# Altium schematic sheet STM32H730_PINOUT.SchDoc
size D; SheetNumber: 2; SheetTotal: 8
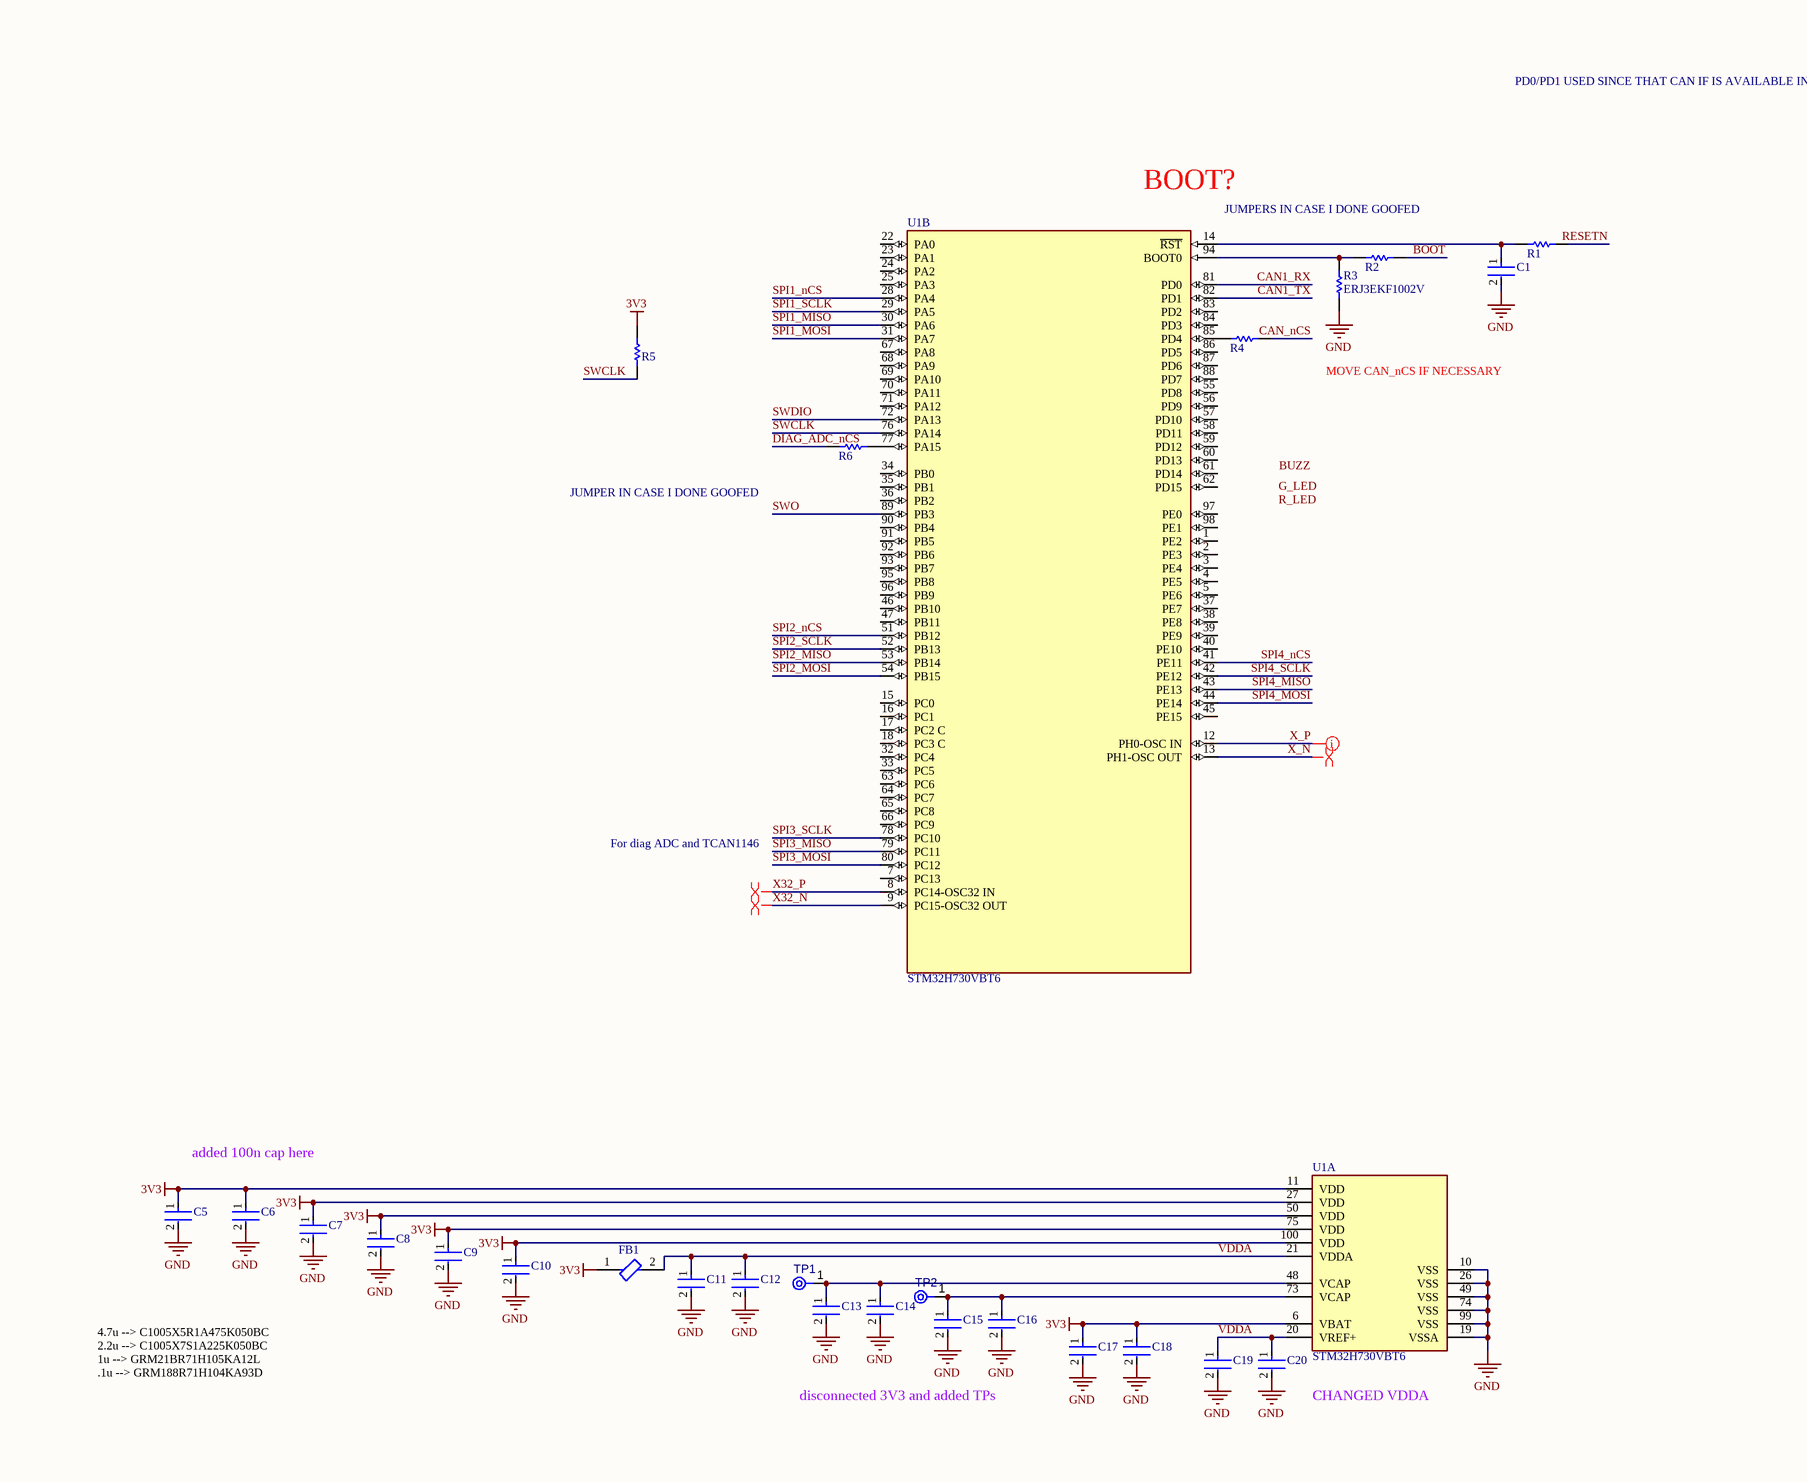
[diagram p0: STM32H730_PINOUT.SchDoc, top left]
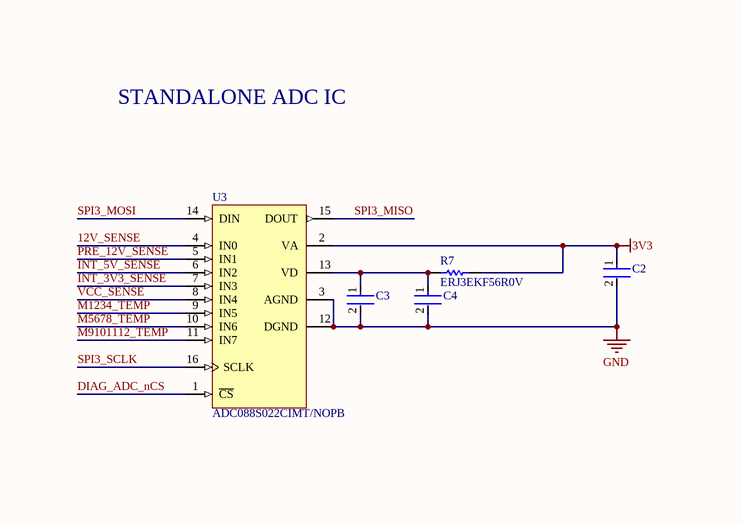
[diagram p1: STM32H730_PINOUT.SchDoc, top middle]
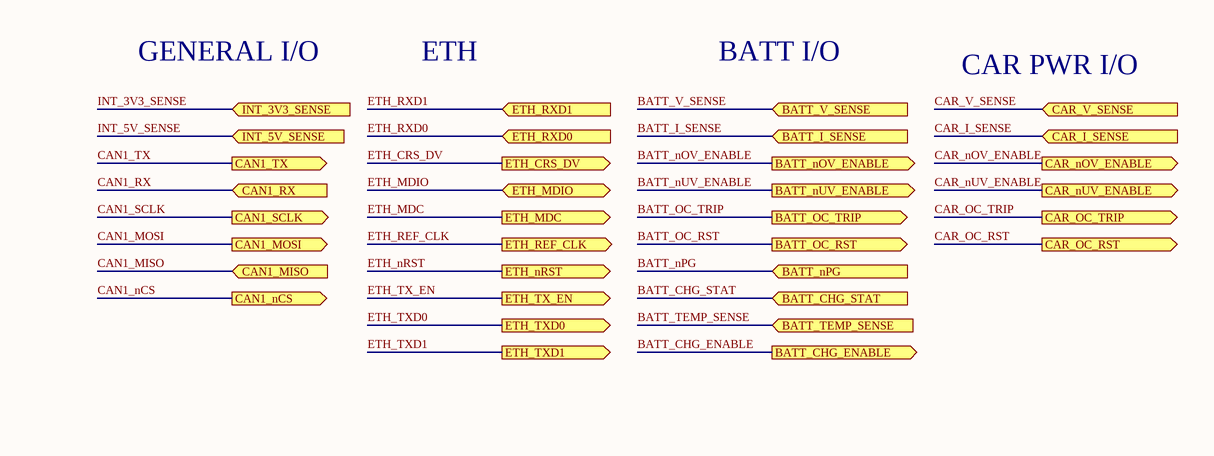
[diagram p2: STM32H730_PINOUT.SchDoc, top right]
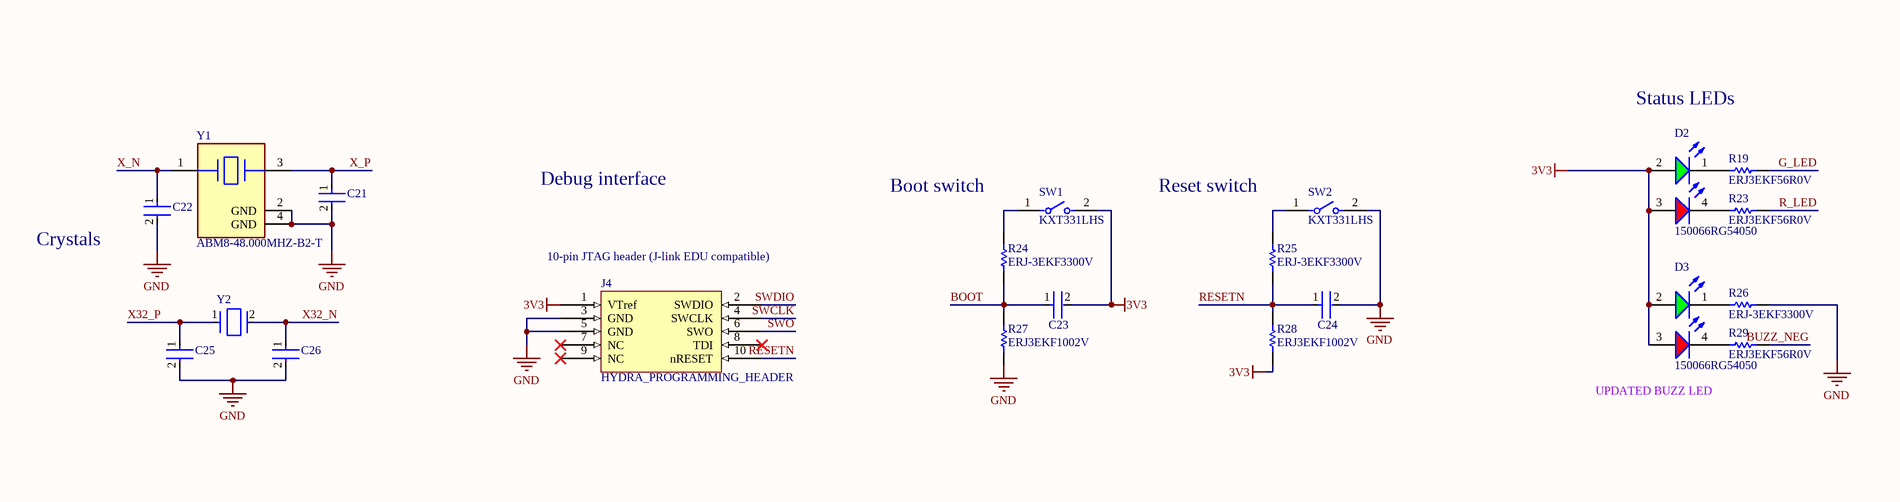
[diagram p3: STM32H730_PINOUT.SchDoc, bottom left]
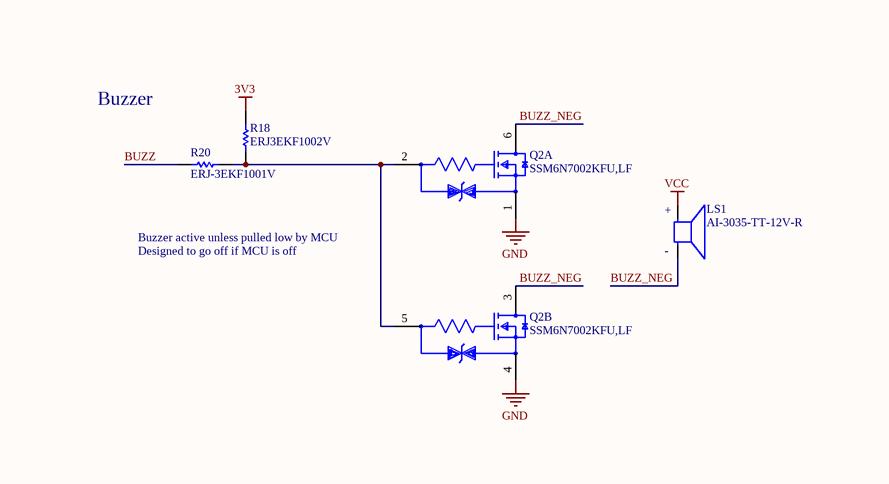
[diagram p4: STM32H730_PINOUT.SchDoc, bottom middle]
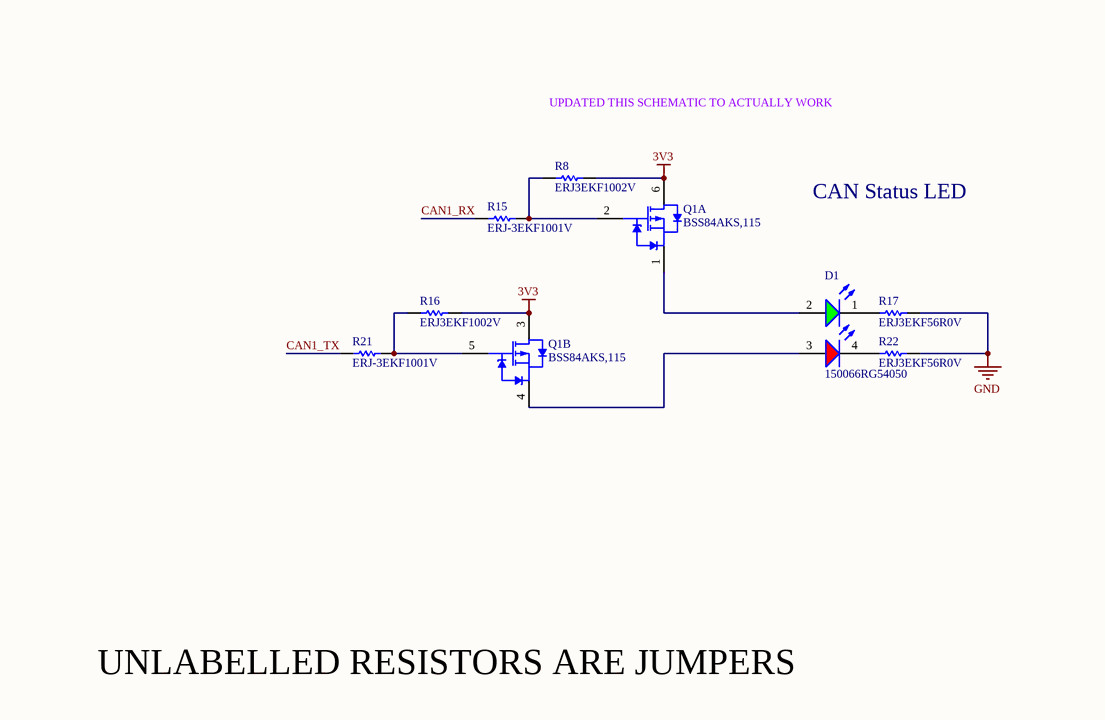
[diagram p5: STM32H730_PINOUT.SchDoc, bottom right]

## Parts
C1  GRM188R71H104KA93D  [FP-0402-L_1_0_0_05-W_0_5-IPC_A]  (value not drawn)
C2  GRM188R71H104KA93D  [FP-0402-L_1_0_0_05-W_0_5-IPC_A]  (value not drawn)
C3  GRM188R71H104KA93D  [FP-0402-L_1_0_0_05-W_0_5-IPC_A]  (value not drawn)
C4  GRM188R71H104KA93D  [FP-0402-L_1_0_0_05-W_0_5-IPC_A]  (value not drawn)
C5  C1005X5R1A475K050BC  [FP-0402-L_1_0_0_05-W_0_5-IPC_A]  (value not drawn)
C6  GRM188R71H104KA93D  [FP-0402-L_1_0_0_05-W_0_5-IPC_A]  (value not drawn)
C7  GRM188R71H104KA93D  [FP-0402-L_1_0_0_05-W_0_5-IPC_A]  (value not drawn)
C8  GRM188R71H104KA93D  [FP-0402-L_1_0_0_05-W_0_5-IPC_A]  (value not drawn)
C9  GRM188R71H104KA93D  [FP-0402-L_1_0_0_05-W_0_5-IPC_A]  (value not drawn)
C10  GRM188R71H104KA93D  [FP-0402-L_1_0_0_05-W_0_5-IPC_A]  (value not drawn)
C11  GRM21BR71H105KA12L  [FP-0402-L_1_0_0_05-W_0_5-IPC_A]  (value not drawn)
C12  GRM188R71H104KA93D  [FP-0402-L_1_0_0_05-W_0_5-IPC_A]  (value not drawn)
C13  C1005X7S1A225K050BC  [FP-0402-L_1_0_0_05-W_0_5-IPC_A]  (value not drawn)
C14  GRM188R71H104KA93D  [FP-0402-L_1_0_0_05-W_0_5-IPC_A]  (value not drawn)
C15  C1005X7S1A225K050BC  [FP-0402-L_1_0_0_05-W_0_5-IPC_A]  (value not drawn)
C16  GRM188R71H104KA93D  [FP-0402-L_1_0_0_05-W_0_5-IPC_A]  (value not drawn)
C17  GRM21BR71H105KA12L  [FP-0402-L_1_0_0_05-W_0_5-IPC_A]  (value not drawn)
C18  GRM188R71H104KA93D  [FP-0402-L_1_0_0_05-W_0_5-IPC_A]  (value not drawn)
C19  GRM21BR71H105KA12L  [FP-0402-L_1_0_0_05-W_0_5-IPC_A]  (value not drawn)
C20  GRM188R71H104KA93D  [FP-0402-L_1_0_0_05-W_0_5-IPC_A]  (value not drawn)
C21  DNO  [FP-0402-L_1_0_0_05-W_0_5-IPC_A]  (value not drawn)
C22  DNO  [FP-0402-L_1_0_0_05-W_0_5-IPC_A]  (value not drawn)
C23  GRM188R71H104KA93D  [FP-0402-L_1_0_0_05-W_0_5-IPC_A]  (value not drawn)
C24  GRM188R71H104KA93D  [FP-0402-L_1_0_0_05-W_0_5-IPC_A]  (value not drawn)
C25  04025A180FAT2A  [FP-0402-L_1_0_0_05-W_0_5-IPC_A]  (value not drawn)
C26  04025A180FAT2A  [FP-0402-L_1_0_0_05-W_0_5-IPC_A]  (value not drawn)
D1  150066RG54050  [WL-SBCD_0606]
D2  150066RG54050  [WL-SBCD_0606]
D3  150066RG54050  [WL-SBCD_0606]
FB1  BLM15PX601SN1D  [FP-BLM15-0_05-MFG]  (value not drawn)
J4  HYDRA_PROGRAMMING_HEADER  [3220-10-0300-00-Footprint-1]
LS1  AI-3035-TT-12V-R  [AI-3035-TT-12V-R-Footprint-1]
Q1  BSS84AKS,115  [NXP-SOT363_L]  (parts A,B of 2)
Q2  SSM6N7002KFU,LF  [FP-SSOP6-P-0_65A-MFG]  (parts A,B of 2)
R1  0402 JUMPER 0 OHM  [RESC1005X40X25NL05T05]  (value not drawn)
R2  0402 JUMPER 0 OHM  [RESC1005X40X25NL05T05]  (value not drawn)
R3  ERJ3EKF1002V  [RESC1609X55X30LL15T15]
R4  0402 JUMPER 0 OHM  [RESC1005X40X25NL05T05]  (value not drawn)
R5  ERJ3EKF1002V  [RESC1609X55X30LL15T15]  (value not drawn)
R6  0402 JUMPER 0 OHM  [RESC1005X40X25NL05T05]  (value not drawn)
R7  ERJ3EKF56R0V  [RESC1608X55X30NL15T15]
R8  ERJ3EKF1002V  [RESC1609X55X30LL15T15]
R15  ERJ-3EKF1001V  [RESC1608X55X30LL15T15]
R16  ERJ3EKF1002V  [RESC1609X55X30LL15T15]
R17  ERJ3EKF56R0V  [RESC1608X55X30NL15T15]
R18  ERJ3EKF1002V  [RESC1609X55X30LL15T15]
R19  ERJ3EKF56R0V  [RESC1608X55X30NL15T15]
R20  ERJ-3EKF1001V  [RESC1608X55X30LL15T15]
R21  ERJ-3EKF1001V  [RESC1608X55X30LL15T15]
R22  ERJ3EKF56R0V  [RESC1608X55X30NL15T15]
R23  ERJ3EKF56R0V  [RESC1608X55X30NL15T15]
R24  ERJ-3EKF3300V  [RESC1608X55X30LL15T15]
R25  ERJ-3EKF3300V  [RESC1608X55X30LL15T15]
R26  ERJ-3EKF3300V  [RESC1608X55X30LL15T15]
R27  ERJ3EKF1002V  [RESC1609X55X30LL15T15]
R28  ERJ3EKF1002V  [RESC1609X55X30LL15T15]
R29  ERJ3EKF56R0V  [RESC1608X55X30NL15T15]
SW1  KXT331LHS  [FP-KXT331LHS-MFG]
SW2  KXT331LHS  [FP-KXT331LHS-MFG]
TP1  TPAD6R  [TP06R]  (value not drawn)  (no BOM)
TP2  TPAD6R  [TP06R]  (value not drawn)  (no BOM)
U1  STM32H730VBT6  [FP-LQFP100-1L-IPC_C]  (parts A,B of 2)
U3  ADC088S022CIMT/NOPB  [MTC16_L]
Y1  ABM8-48.000MHZ-B2-T  [FP-ABM8-MFG]
Y2  ECS-.327-12.5-1210-TR  [FP-ECX-1210-MFG]  (value not drawn)

## Ports
BATT_CHG_ENABLE (out, see BRZ_BATT_MGR[4B]), BATT_CHG_STAT (in, see BRZ_BATT_MGR[4B]), BATT_I_SENSE (in, see BRZ_BATT_MGR[4B]), BATT_nOV_ENABLE (out, see BRZ_BATT_MGR[4B]), BATT_nPG (in, see BRZ_BATT_MGR[4B]), BATT_nUV_ENABLE (out, see BRZ_BATT_MGR[4B]), BATT_OC_RST (out, see BRZ_BATT_MGR[4B]), BATT_OC_TRIP (out, see BRZ_BATT_MGR[4B]), BATT_TEMP_SENSE (in, see BRZ_BATT_MGR[4B]), BATT_V_SENSE (in, see BRZ_BATT_MGR[4B]), CAN1_MISO (in, see BRZ_BATT_MGR[5A]), CAN1_MOSI (out, see BRZ_BATT_MGR[5A]), CAN1_nCS (out, see BRZ_BATT_MGR[5A]), CAN1_RX (in, see BRZ_BATT_MGR[5A]), CAN1_SCLK (out, see BRZ_BATT_MGR[5A]), CAN1_TX (out, see BRZ_BATT_MGR[5A]), CAR_I_SENSE (in, see BRZ_BATT_MGR[4C]), CAR_nOV_ENABLE (out, see BRZ_BATT_MGR[4C]), CAR_nUV_ENABLE (out, see BRZ_BATT_MGR[4C]), CAR_OC_RST (out, see BRZ_BATT_MGR[4C]), CAR_OC_TRIP (out, see BRZ_BATT_MGR[4C]), CAR_V_SENSE (in, see BRZ_BATT_MGR[4C]), ETH_CRS_DV (out, see BRZ_BATT_MGR[5C], ETH[1A]), ETH_MDC (out, see BRZ_BATT_MGR[5C], ETH[1A]), ETH_MDIO (bidir, see BRZ_BATT_MGR[5C], ETH[1A]), ETH_nRST (out, see BRZ_BATT_MGR[5C], ETH[1A]), ETH_REF_CLK (out, see BRZ_BATT_MGR[5C], ETH[1A]), ETH_RXD0 (in, see BRZ_BATT_MGR[5C], ETH[1A]), ETH_RXD1 (in, see BRZ_BATT_MGR[5C], ETH[1A]), ETH_TX_EN (out, see BRZ_BATT_MGR[5C], ETH[1A]), ETH_TXD0 (out, see BRZ_BATT_MGR[5C], ETH[1A]), ETH_TXD1 (out, see BRZ_BATT_MGR[5C], ETH[1A]), INT_3V3_SENSE (in, see BRZ_BATT_MGR[4A], INT_REG[4A]), INT_5V_SENSE (in, see BRZ_BATT_MGR[4A], INT_REG[4B])

## Nets
3V3: C2.1 C5.1 C6.1 C7.1 C8.1 C9.1 C10.1 C17.1 C18.1 C23.2 D2.2(A) D2.3(A) D3.2(A) D3.3(A) FB1.1 J4.1(VTref) Q1.3(D2) Q1.6(D1) R5.1 R7.1 R8.2 R16.2 R18.2 R28.1 SW1.2 U1.6(VBAT) U1.11(VDD) U1.27(VDD) U1.50(VDD) U1.75(VDD) U1.100(VDD) U3.2(VA)
GND: C1.2 C2.2 C3.2 C4.2 C5.2 C6.2 C7.2 C8.2 C9.2 C10.2 C11.2 C12.2 C13.2 C14.2 C15.2 C16.2 C17.2 C18.2 C19.2 C20.2 C21.2 C22.2 C24.2 C25.2 C26.2 J4.3(GND) J4.5(GND) Q2.1(Source1) Q2.4(Source2) R3.1 R17.1 R22.1 R26.2 R27.1 SW2.2 U1.10(VSS) U1.19(VSSA) U1.26(VSS) U1.49(VSS) U1.74(VSS) U1.99(VSS) U3.3(AGND) U3.12(DGND) Y1.2(GND) Y1.4(GND)
VCC: LS1.P
12V_SENSE: U3.4(IN0)
BATT_CHG_ENABLE: port BATT_CHG_ENABLE
BATT_CHG_STAT: port BATT_CHG_STAT
BATT_I_SENSE: port BATT_I_SENSE
BATT_nOV_ENABLE: port BATT_nOV_ENABLE
BATT_nPG: port BATT_nPG
BATT_nUV_ENABLE: port BATT_nUV_ENABLE
BATT_OC_RST: port BATT_OC_RST
BATT_OC_TRIP: port BATT_OC_TRIP
BATT_TEMP_SENSE: port BATT_TEMP_SENSE
BATT_V_SENSE: port BATT_V_SENSE
BOOT: C23.1 R2.2 R24.1 R27.2
BUZZ: R20.1
BUZZ_NEG: LS1.N Q2.3(Drain2) Q2.6(Drain1) R29.1
CAN1_MISO: port CAN1_MISO
CAN1_MOSI: port CAN1_MOSI
CAN1_nCS: port CAN1_nCS
CAN1_RX: R15.1 U1.81(PD0) ; port CAN1_RX
CAN1_SCLK: port CAN1_SCLK
CAN1_TX: R21.1 U1.82(PD1) ; port CAN1_TX
CAN_nCS: R4.2
CAR_I_SENSE: port CAR_I_SENSE
CAR_nOV_ENABLE: port CAR_nOV_ENABLE
CAR_nUV_ENABLE: port CAR_nUV_ENABLE
CAR_OC_RST: port CAR_OC_RST
CAR_OC_TRIP: port CAR_OC_TRIP
CAR_V_SENSE: port CAR_V_SENSE
DIAG_ADC_nCS: R6.1 U3.1(~{CS})
ETH_CRS_DV: port ETH_CRS_DV
ETH_MDC: port ETH_MDC
ETH_MDIO: port ETH_MDIO
ETH_nRST: port ETH_nRST
ETH_REF_CLK: port ETH_REF_CLK
ETH_RXD0: port ETH_RXD0
ETH_RXD1: port ETH_RXD1
ETH_TX_EN: port ETH_TX_EN
ETH_TXD0: port ETH_TXD0
ETH_TXD1: port ETH_TXD1
G_LED: R19.1
INT_3V3_SENSE: U3.7(IN3) ; port INT_3V3_SENSE
INT_5V_SENSE: U3.6(IN2) ; port INT_5V_SENSE
M1234_TEMP: U3.9(IN5)
M5678_TEMP: U3.10(IN6)
M9101112_TEMP: U3.11(IN7)
PRE_12V_SENSE: U3.5(IN1)
R_LED: R23.1
RESETN: C24.1 J4.10(nRESET) R1.2 R25.1 R28.2
SPI1_MISO: U1.30(PA6)
SPI1_MOSI: U1.31(PA7)
SPI1_nCS: U1.28(PA4)
SPI1_SCLK: U1.29(PA5)
SPI2_MISO: U1.53(PB14)
SPI2_MOSI: U1.54(PB15)
SPI2_nCS: U1.51(PB12)
SPI2_SCLK: U1.52(PB13)
SPI3_MISO: U1.79(PC11) U3.15(DOUT)
SPI3_MOSI: U1.80(PC12) U3.14(DIN)
SPI3_SCLK: U1.78(PC10) U3.16(SCLK)
SPI4_MISO: U1.43(PE13)
SPI4_MOSI: U1.44(PE14)
SPI4_nCS: U1.41(PE11)
SPI4_SCLK: U1.42(PE12)
SWCLK: J4.4(SWCLK) R5.2 U1.76(PA14)
SWDIO: J4.2(SWDIO) U1.72(PA13)
SWO: J4.6(SWO) U1.89(PB3)
VCC_SENSE: U3.8(IN4)
VDDA: C11.1 C12.1 C19.1 C20.1 FB1.2 U1.20(VREF+) U1.21(VDDA)
X32_N: C26.1 U1.9(PC15-OSC32_OUT) Y2.2(Out/In)
X32_P: C25.1 U1.8(PC14-OSC32_IN) Y2.1(In/Out)
X_N: C22.1 U1.13(PH1-OSC_OUT) Y1.1
X_P: C21.1 U1.12(PH0-OSC_IN) Y1.3
NetC1_1: C1.1 R1.1 U1.14(~{RST})
NetC3_1: C3.1 C4.1 R7.2 U3.13(VD)
NetC13_1: C13.1 C14.1 TP1.1(TP) U1.48(VCAP)
NetC15_1: C15.1 C16.1 TP2.1(TP) U1.73(VCAP)
NetD1_1: D1.1(K) R17.2
NetD1_2: D1.2(A) Q1.1(S1)
NetD1_3: D1.3(A) Q1.4(S2)
NetD1_4: D1.4(K) R22.2
NetD2_1: D2.1(K) R19.2
NetD2_4: D2.4(K) R23.2
NetD3_1: D3.1(K) R26.1
NetD3_4: D3.4(K) R29.2
NetQ1_2: Q1.2(G1) R8.1 R15.2
NetQ1_5: Q1.5(G2) R16.1 R21.2
NetQ2_2: Q2.2(Gate1) Q2.5(Gate2) R18.1 R20.2
NetR2_1: R2.1 R3.2 U1.94(BOOT0)
NetR4_1: R4.1 U1.85(PD4)
NetR6_2: R6.2 U1.77(PA15)
NetR24_2: R24.2 SW1.1
NetR25_2: R25.2 SW2.1

Not connected (* = marked no-connect by the designer): J4 7(NC)* 8(TDI)* 9(NC)*; U1 1(PE2) 2(PE3) 3(PE4) 4(PE5) 5(PE6) 7(PC13) 15(PC0) 16(PC1) 17(PC2_C) 18(PC3_C) 22(PA0) 23(PA1) 24(PA2) 25(PA3) 32(PC4) 33(PC5) 34(PB0) 35(PB1) 36(PB2) 37(PE7) 38(PE8) 39(PE9) 40(PE10) 45(PE15) 46(PB10) 47(PB11) 55(PD8) 56(PD9) 57(PD10) 58(PD11) 59(PD12) 60(PD13) 61(PD14) 62(PD15) 63(PC6) 64(PC7) 65(PC8) 66(PC9) 67(PA8) 68(PA9) 69(PA10) 70(PA11) 71(PA12) 83(PD2) 84(PD3) 86(PD5) 87(PD6) 88(PD7) 90(PB4) 91(PB5) 92(PB6) 93(PB7) 95(PB8) 96(PB9) 97(PE0) 98(PE1)

## Layout directives
differential pair: X32_N, X32_P, X_N, X_P

## Notes on the sheet
- GENERAL I/O
- ETH
- BATT I/O
- PD0/PD1 USED SINCE THAT CAN IF IS AVAILABLE IN BOOTLOADER MODE
- CAR PWR I/O
- (near U1) BOOT?
- JUMPERS IN CASE I DONE GOOFED
- MOVE CAN_nCS IF NECESSARY
- STANDALONE ADC IC
- JUMPER IN CASE I DONE GOOFED
- For diag ADC and TCAN1146
- added 100n cap here
- disconnected 3V3 and added TPs
- CHANGED VDDA
- 4.7u --> C1005X5R1A475K050BC
  2.2u --> C1005X7S1A225K050BC
  1u --> GRM21BR71H105KA12L
  .1u --> GRM188R71H104KA93D
- UPDATED THIS SCHEMATIC TO ACTUALLY WORK
- CAN Status LED
- Status LEDs
- Buzzer
- Debug interface
- Boot switch
- Reset switch
- (near C22) Crystals
- (near J4) 10-pin JTAG header (J-link EDU compatible)
- Buzzer active unless pulled low by MCU
- Designed to go off if MCU is off
- UPDATED BUZZ LED
- UNLABELLED RESISTORS ARE JUMPERS
- Labels drawn without touching a wire or pin: BUZZ, G_LED, R_LED
- (in symbol CMP-00027-00003-1) +; -

## Library data of the parts
C1-C26 = CMP-001-00058-1: LARGE PADS, 0402 CAP, CHANGE COMMENT TO MATCH REAL P/N; Capacitor Type: Ceramic; Min Operating Temperature: -55°C; Mounting Technology: Surface Mount; Pins: 2; Case/Package: 0402; RoHS Compliant: Yes; Max Operating Temperature: 85°C
D1-D3 = CMP-004-00034-2: Led, Red/Grn, 180Mcd/230Mcd, 624Nm/525Nm Rohs Compliant: Yes
FB1 = CMP-0686-00252-4: Chip Ferrite Bead, 0402, 600Ω @ 100MHz, 0.23Ω, 25%, 900mA; Number of Circuits: 1; Impedance: 600R; DC Resistance (DCR): 230mR; Material: Steel; Length: 1mm; Package Quantity: 10000; Height: 0.5mm; Width: 0.5mm; Max DC Current: 900mA; Number of Lines: 1; Termination: SMD/SMT; Packaging: Tape and Reel; Lead Free: Lead Free; Min Operating Temperature: -55°C; Max Operating Temperature: 125°C; Max Current Rating: 900mA; Case Code (Imperial): 0402; Number of Pins: 2; Current Rating: 900mA; Test Frequency: 100MHz; Case/Package: 0402; Tolerance: 25%; Case Code (Metric): 1005
J4 = CMP-002-00075-1: CONN HEADER SMD 10POS 1.27MM (specifically compatible with J-Link EDU cable) PN: 3220-10-0300-00
LS1 = CMP-00027-00003-1: Audio Indicator 12V 12mA 110dBA 3.5KHz Resonant Frequency Thru-Hole
Q1 = CMP-1259-00116-1: Dual P-Channel Trench MOSFET, -50 V, -0.16 A, -55 to 150 degC, 6-Pin SOT363, Tape and Reel; Manufacturer: NXP Semiconductors; VGSth [typ] (V): -1.6; Automotive Qualified: Y; Channel Type: P; IDM [max] (A): -0.64; Packing: Tape & Reel; Mounting Technology: Surface Mount; PackageDescription: 6-Pin Small Outline Transistor Package, Body 2 x 1.25 mm, Pitch 0.65 mm; ComponentLink2URL: http://www.nxp.com/documents/data_sheet/BSS84AKS.pdf; ComponentLink3URL: http://www.nxp.com/documents/outline_drawing/sot363_po.pdf; PartNumber: BSS84AKS,115; PackageReference: SOT363; PackageVersion: 06-03-16, 03/2006; ComponentLink3Description: Package Specification; ComponentLink2Description: Datasheet; ComponentLink1Description: Manufacturer URL; VDS [max] (V): -50; Code_JEITA: SC-88; ID [max] (A): -0.16; DatasheetVersion: Rev. 1; ComponentLink1URL: http://www.nxp.com/
Q2 = CMP-35916-000009-1: MOSFET 2N-CH 60V 0.3A; Input Capacitance: 40pF; Continuous Drain Current (ID): 300mA; Max Power Dissipation: 285mW; FET Type: 2 N-Channel; Rds On Max: 1.5R; Mount: Surface Mount; Drain to Source Voltage (Vdss): 60V; Packaging: Tape and Reel
R1 R2 R4 R6 = CMP-009-00206-2: READ THE NAME
R3 R5 R8 R16 R18 R27 R28 = CMP-1012-00623-3: Chip Resistor, 10 KOhm, +/- 1%, 0.1 W, -55 to 155 degC, 0603 (1608 Metric), RoHS, Tape and Reel; Manufacturer: Panasonic; Voltage Rating: 75V; Case\/Package: 0603; Power Rating: 100mW; Resistance: 10KOhm; Temperature Coefficient: 100ppm\/degreesC; Number of Pins: 2; Package Reference: 603; Depth: 0.8mm; Mount: SurfaceMount; Package Description: 2-Pin Surface Mount Device, Body 1.6 x 0.85 mm; Datasheet Version: 02/2017; Length: 1.6mm; Lead Free: LeadFree; Height: 0.45mm; Number of Terminations: 2; Max Power Dissipation: 100mW; Min Operating Temperature: -55degC; Datasheet URL: https://industrial.panasonic.com/cdbs/www-data/pdf/RDA0000/AOA0000C304.pdf; Termination: SMD/SMT; Case Code (Metric): 1608; Case Code (Imperial): 0603; Tolerance: 1%; Max Operating Temperature: 155degC; RoHSCompliant: true; Voltage Rating (DC): 75V; Radiation Hardening: No; Packaging: TapeandReel; Composition: ThickFilm; Mounting Technology: SurfaceMount; Manufacturer URL: http://www.panasonic.com/; Width: 0.031inch; REACH SVHC: NoSVHC; Contact Plating: Tin; Military Standard: Not; Package Quantity: 1
R7 R17 R19 R22 R23 R29 = CMP-2000-00572-1: Manufacturer: Panasonic; Part Number: ERJ3EKF56R0V
R15 R20 R21 = CMP-2000-00180-1: Manufacturer: Panasonic; Part Number: ERJ-3EKF1001V
R24-R26 = CMP-2000-00435-2: Chip Resistor, 330 Ohm, +/- 1%, 0.1 W, -55 to 155 degC, 0603 (1608 Metric), RoHS, Tape and Reel; Gender: Male; Mating Cycles: 10000; Current Rating: 500 mA; Voltage Rating: 10 V; REACH SVHC: No SVHC; PackageDescription: 2-Pin Surface Mount Device, Body 1.6 x 0.85 mm; Contact Finish: Gold; Pins: 8; ComponentLink1Description: Manufacturer URL; Packaging: Tape and Reel; Max Operating Temperature: 85 degC; Contact Material: Copper; Height: 1.45 mm; Width: 1.45 mm; DatasheetVersion: Apr-15; Package Quantity: 1500; Contact Plating: Gold; PackageReference: 0603; Mount: Surface Mount; Lead Pitch: 1.1 mm; Min Operating Temperature: -25 degC; ComponentLink1URL: http://www.panasonic.com/; ComponentLink2URL: http://industrial.panasonic.com/cdbs/www-data/pdf/RDA0000/AOA0000C86.pdf; Length: 13.7 mm; ComponentLink2Description: Datasheet; RoHSCompliant: true
SW1 SW2 = CMP-10040-000029-1: SWITCH TACTILE SPST-NO 0.02A 15V; Operating Force: 240gf; Switch Travel: 0.13mm; Illumination Type: Non-Illuminated; Throw Configuration: SPST; Number of Ports: 1; Current Rating: 5A; Mechanical Life: 500000Cycles; Switch Function: Off-Mom; Connector Type: USB; Actuator Type: Standard; Gender: Receptacle; Number of Contacts: 24; Contact Plating: Gold; Insulation Color: Black; Min Operating Temperature: -40°C; Packaging: Tape and Reel; Flammability Rating: UL94 V-0; Max Operating Temperature: 85°C; Termination: Solder; Mount: Surface Mount
TP1 TP2 = CMP-00028-00002-2: 0.6mm round; Pins: 1
U1 = CMP-12105-000107-1: IC MCU 32BIT 128KB FLASH 100LQFP
U3 = CMP-0054-00372-2: 8-Channel, 50 kSPS to 200 kSPS, 8-Bit A/D Converter, 16-pin TSSOP, Pb-Free; Manufacturer: National Semiconductor; PackageTopMarking: NSUZXYTT*88S022*CIMT; CompType: ADC IC; PowerWise: Y; ComponentLink2URL: http://www.national.com/pf/AD/ADC088S022.html; RoHS: Y; PackageDescription: Molded TSSOP, Jedec, 5 x 4.4 x 0.9mm Body, 16 Lead, 0.65mm Pitch; DatasheetVersion: Feb-2010; PinCount: 16; ComponentLink1Description: ADC088S022 Datasheet; Code_JEDEC: MO-153-AB; ComponentLink3URL: http://www.national.com/packaging/folders/mtc16.html; PackageVersion: revD, Jun-2003; ComponentLink3Description: MTC16 Package Page; RevisionNote: Component URLs added; ComponentLink1URL: http://www.national.com/ds/AD/ADC088S022.pdf; ComponentLink2Description: ADC088S022 Web Page; PackageReference: MTC16
Y1 = CMP-27762-011708-1: Crystal 48MHz ±20ppm 18pF SMD-4 3.2mm x 2.5mm; Series Resistance: 35R; Frequency Stability: 50ppm; Package Quantity: 1000; Packaging: Tape and Reel; Mount: Surface Mount; Length: 3.2mm; Load Capacitance: 18pF; Max Operating Temperature: 70°C; Operating Frequency: 48 MHz; RoHS Compliant: Yes; Series: ABM8; Frequency Tolerance: 20ppm; Lead Free: Lead Free; Min Operating Temperature: -20°C; Case/Package: CSMD; Number of Pins: 4; Height: 0.031inch; ESR (Equivalent Series Resistance): 35R; Frequency: 48MHz; Radiation Hardening: No; Width: 0.098inch; Tolerance: 20ppm; Termination: SMD/SMT; Depth: 2.5mm; Resistor Type: Ceramic; REACH SVHC: No SVHC
Y2 = CMP-40224-000006-1: CRYSTAL 32.7680KHZ 12.5PF SMD; Manufacturer: ECS International; Frequency: 32.768kHz; Esr: 90kΩ; Tolerance: 20ppm; Device Class L1: Passive Components; Load Capacitance: 12.5pF; Temperature: -40°C to +85°C; ComponentLink2URL: https://ecsxtal.com/store/pdf/ECX-1210.pdf; Series: ECX-1210; Octopart: https://octopart.com/ecs-.327-12.5-1210-tr-ecs+international-81221340; ComponentLink2Description: Datasheet; Temperature Range Low: -40°C; Digikey Description: CRYSTAL 32.7680KHZ 12.5PF SMD; Lead Free: Yes; RoHS: TRUE; Device Class L3: Crystals; Automotive: No; Category: Crys; Height: 0.5mm; Manufacturer Part Number: ECS-.327-12.5-1210-TR; Temperature Range High: +85°C; Device Class L2: Crystals / Oscillators; Package: ECX-1210